# Altium schematic sheet 11-UWB-Main.SchDoc
size A; SheetNumber: 11; SheetTotal: 16
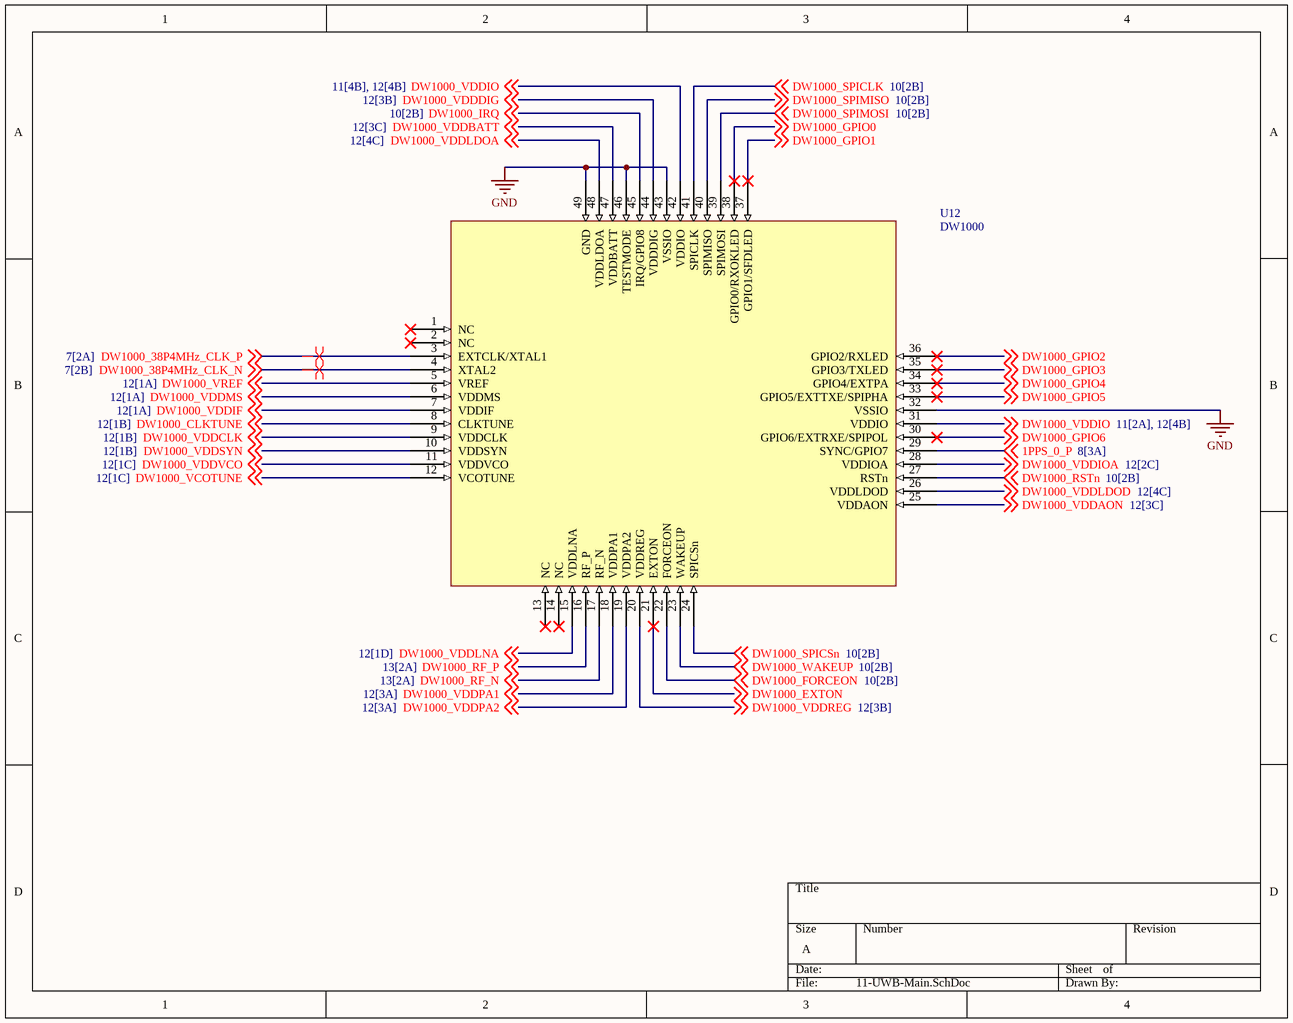
[diagram p0: 11-UWB-Main.SchDoc]

## Parts
U12  DW1000  [DW1000_Footprint]

## Nets
GND: U12.32(VSSIO) U12.43(VSSIO) U12.46(TESTMODE) U12.49(GND)
1PPS_0_P: U12.29(SYNC/GPIO7) ; off-sheet 1PPS_0_P
DW1000_38P4MHz_CLK_N: U12.4(XTAL2) ; off-sheet DW1000_38P4MHz_CLK_N
DW1000_38P4MHz_CLK_P: U12.3(EXTCLK/XTAL1) ; off-sheet DW1000_38P4MHz_CLK_P
DW1000_CLKTUNE: U12.8(CLKTUNE) ; off-sheet DW1000_CLKTUNE
DW1000_EXTON: U12.21(EXTON) ; off-sheet DW1000_EXTON
DW1000_FORCEON: U12.22(FORCEON) ; off-sheet DW1000_FORCEON
DW1000_GPIO0: U12.38(GPIO0/RXOKLED) ; off-sheet DW1000_GPIO0
DW1000_GPIO1: U12.37(GPIO1/SFDLED) ; off-sheet DW1000_GPIO1
DW1000_GPIO2: U12.36(GPIO2/RXLED) ; off-sheet DW1000_GPIO2
DW1000_GPIO3: U12.35(GPIO3/TXLED) ; off-sheet DW1000_GPIO3
DW1000_GPIO4: U12.34(GPIO4/EXTPA) ; off-sheet DW1000_GPIO4
DW1000_GPIO5: U12.33(GPIO5/EXTTXE/SPIPHA) ; off-sheet DW1000_GPIO5
DW1000_GPIO6: U12.30(GPIO6/EXTRXE/SPIPOL) ; off-sheet DW1000_GPIO6
DW1000_IRQ: U12.45(IRQ/GPIO8) ; off-sheet DW1000_IRQ
DW1000_RF_N: U12.17(RF_N) ; off-sheet DW1000_RF_N
DW1000_RF_P: U12.16(RF_P) ; off-sheet DW1000_RF_P
DW1000_RSTn: U12.27(RSTn) ; off-sheet DW1000_RSTn
DW1000_SPICLK: U12.41(SPICLK) ; off-sheet DW1000_SPICLK
DW1000_SPICSn: U12.24(SPICSn) ; off-sheet DW1000_SPICSn
DW1000_SPIMISO: U12.40(SPIMISO) ; off-sheet DW1000_SPIMISO
DW1000_SPIMOSI: U12.39(SPIMOSI) ; off-sheet DW1000_SPIMOSI
DW1000_VCOTUNE: U12.12(VCOTUNE) ; off-sheet DW1000_VCOTUNE
DW1000_VDDAON: U12.25(VDDAON) ; off-sheet DW1000_VDDAON
DW1000_VDDBATT: U12.47(VDDBATT) ; off-sheet DW1000_VDDBATT
DW1000_VDDCLK: U12.9(VDDCLK) ; off-sheet DW1000_VDDCLK
DW1000_VDDDIG: U12.44(VDDDIG) ; off-sheet DW1000_VDDDIG
DW1000_VDDIF: U12.7(VDDIF) ; off-sheet DW1000_VDDIF
DW1000_VDDIO: U12.31(VDDIO) U12.42(VDDIO) ; off-sheet DW1000_VDDIO
DW1000_VDDIOA: U12.28(VDDIOA) ; off-sheet DW1000_VDDIOA
DW1000_VDDLDOA: U12.48(VDDLDOA) ; off-sheet DW1000_VDDLDOA
DW1000_VDDLDOD: U12.26(VDDLDOD) ; off-sheet DW1000_VDDLDOD
DW1000_VDDLNA: U12.15(VDDLNA) ; off-sheet DW1000_VDDLNA
DW1000_VDDMS: U12.6(VDDMS) ; off-sheet DW1000_VDDMS
DW1000_VDDPA1: U12.18(VDDPA1) ; off-sheet DW1000_VDDPA1
DW1000_VDDPA2: U12.19(VDDPA2) ; off-sheet DW1000_VDDPA2
DW1000_VDDREG: U12.20(VDDREG) ; off-sheet DW1000_VDDREG
DW1000_VDDSYN: U12.10(VDDSYN) ; off-sheet DW1000_VDDSYN
DW1000_VDDVCO: U12.11(VDDVCO) ; off-sheet DW1000_VDDVCO
DW1000_VREF: U12.5(VREF) ; off-sheet DW1000_VREF
DW1000_WAKEUP: U12.23(WAKEUP) ; off-sheet DW1000_WAKEUP

Not connected (* = marked no-connect by the designer): U12 1(NC)* 2(NC)* 13(NC)* 14(NC)*

## Layout directives
differential pair: DW1000_38P4MHz_CLK_N, DW1000_38P4MHz_CLK_P